# EAGLE design windmast2 (EAGLE 6.1)
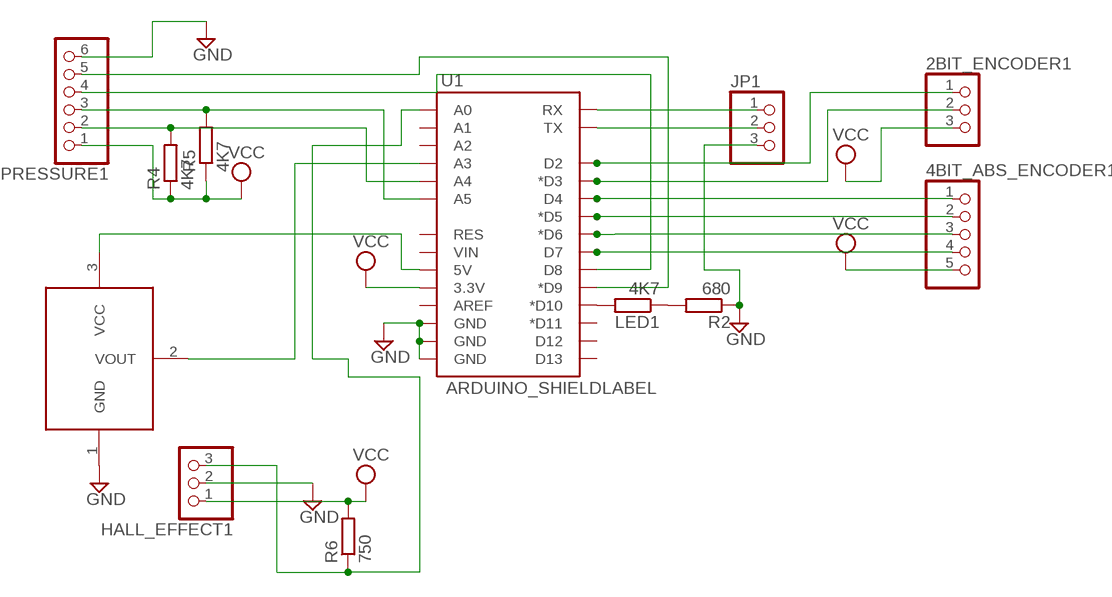
[diagram p0: schematic, sheet 1]

## Parts
2BIT_ENCODER1  PINHD-1X3  [1X03]
4BIT_ABS_ENCODER1  PINHD-1X5  [1X05]
HALL_EFFECT1  PINHD-1X3  [1X03]
IC1  LM35  [TO92]
JP1  PINHD-1X3  [1X03]
LED1  4K7  R-EU_R0805  [R0805]
PRESSURE1  PINHD-1X6  [1X06]
R2  680  R-EU_R0805  [R0805]
R4  4K7  R-EU_R0805  [R0805]
R5  4K7  R-EU_R0805  [R0805]
R6  750  R-EU_R0805  [R0805]
U1  ARDUINO_SHIELDLABEL  [DUEMILANOVE_SHIELD]

## Nets
GND: HALL_EFFECT1.2 IC1.1(GND) JP1.3 PRESSURE1.6 R2.1 U1.GND@0(GND) U1.GND@1(GND) U1.GND@2(GND)
N$1: IC1.2(VOUT) U1.A3
N$2: IC1.3(VCC) U1.5V
N$3: LED1.2 U1.D10(*D10)
N$4: LED1.1 R2.2
N$5: JP1.1 U1.RX
N$6: JP1.2 U1.TX
N$7: PRESSURE1.2 R4.2 U1.A4
N$13: PRESSURE1.3 R5.2 U1.A5
N$14: PRESSURE1.4 U1.D8
N$15: PRESSURE1.5 U1.D9(*D9)
N$16: 2BIT_ENCODER1.1 U1.D2
N$17: 2BIT_ENCODER1.2 U1.D3(*D3)
N$18: 4BIT_ABS_ENCODER1.1 U1.D4
N$19: 4BIT_ABS_ENCODER1.2 U1.D5(*D5)
N$20: 4BIT_ABS_ENCODER1.3 U1.D6(*D6)
N$21: 4BIT_ABS_ENCODER1.4 U1.D7
N$22: HALL_EFFECT1.3 R6.1 U1.A0
VCC: 2BIT_ENCODER1.3 4BIT_ABS_ENCODER1.5 HALL_EFFECT1.1 PRESSURE1.1 R4.1 R5.1 R6.2 U1.3.3V
Unconnected: U1.A1 U1.A2 U1.AREF U1.D11(*D11) U1.D12 U1.D13 U1.RES U1.VIN

## Library data of the parts
2BIT_ENCODER1 HALL_EFFECT1 JP1 = pinhead:PINHD-1X3: PIN HEADER
4BIT_ABS_ENCODER1 = pinhead:PINHD-1X5: PIN HEADER
IC1 = LM35:LM35
LED1 R2 R4-R6 = resistor:R-EU_: RESISTOR, European symbol
PRESSURE1 = pinhead:PINHD-1X6: PIN HEADER
U1 = SparkFun-Boards:ARDUINO_SHIELD: Arduino shield footprint

## Board
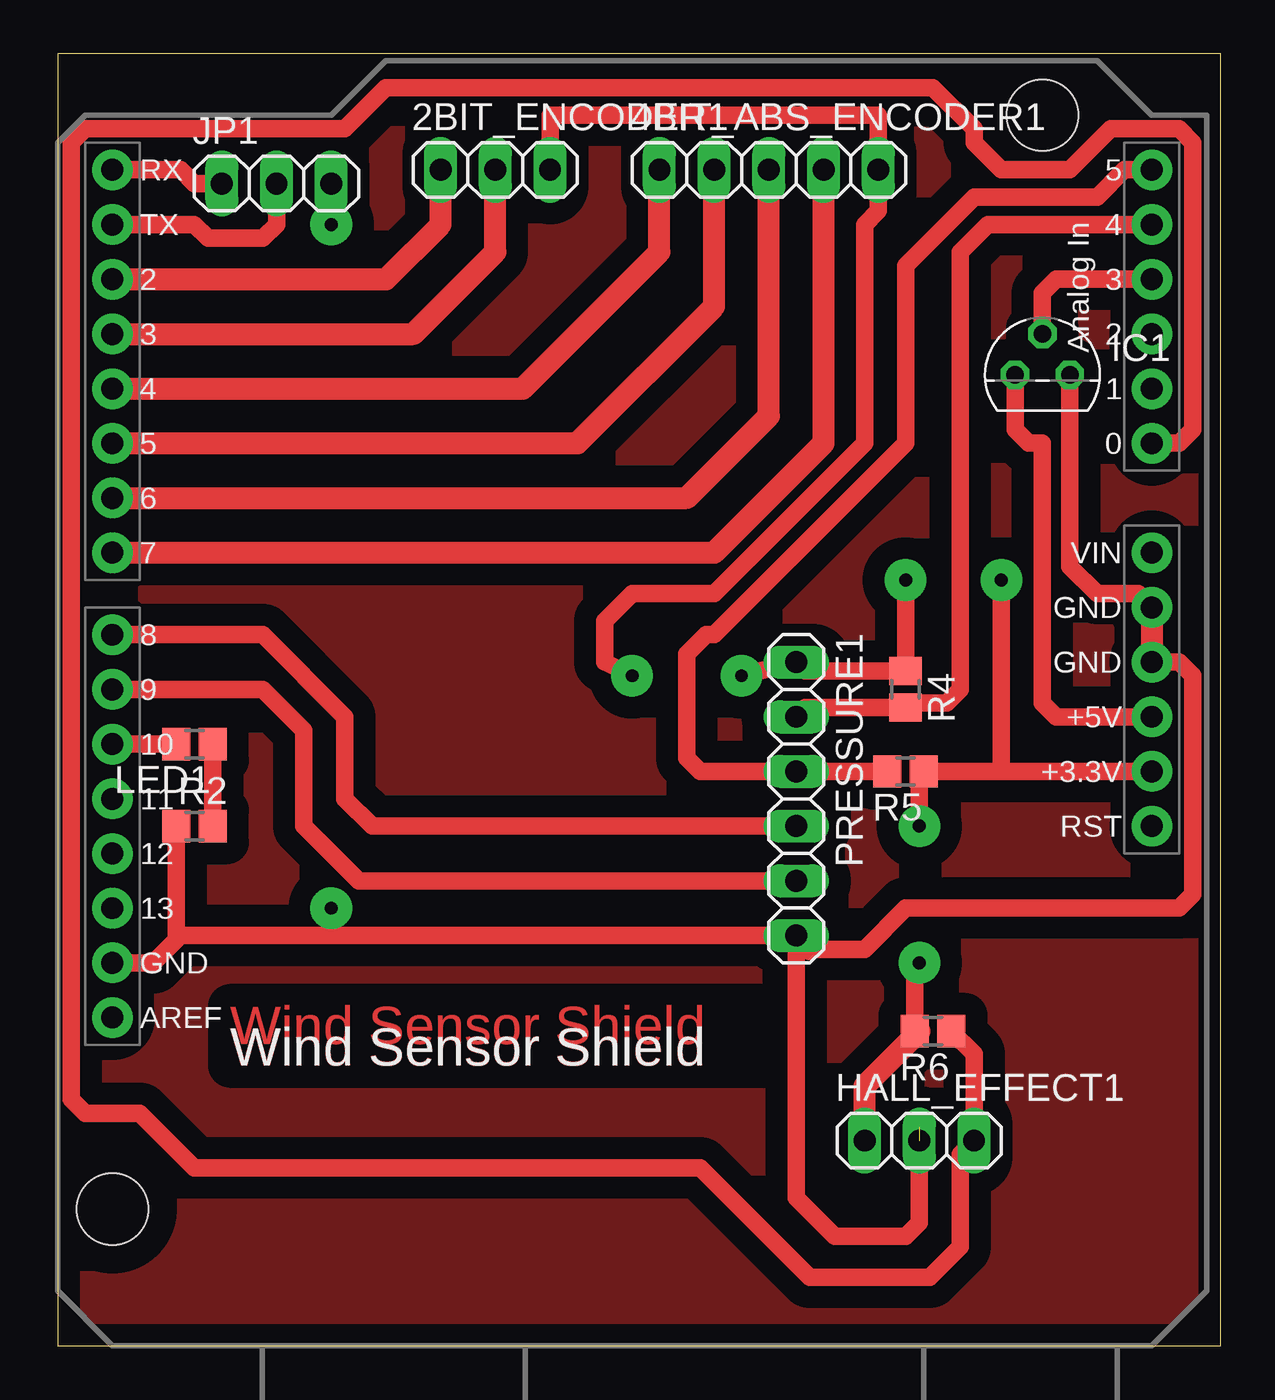
[diagram p1: board, top side]
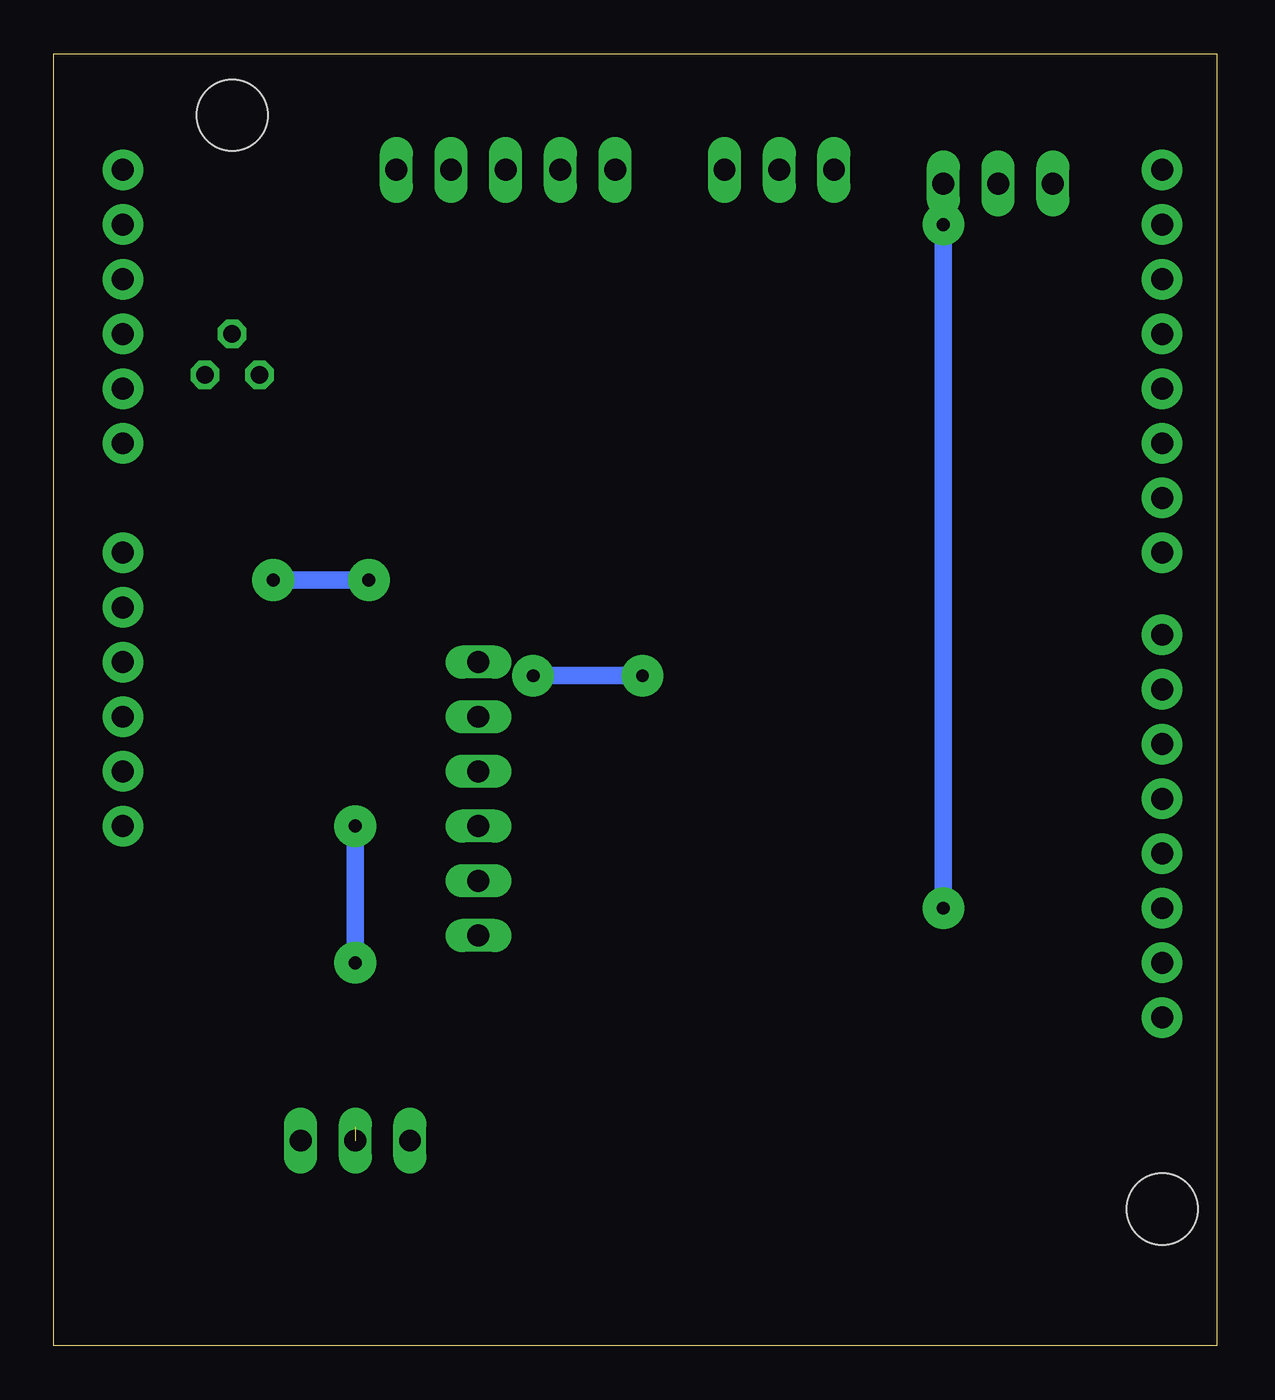
[diagram p2: board, bottom side, seen from below]

Size 54 x 60 mm. Coordinates in mm from the lower left corner, seen from the top.
Outline: 0,0 54,0 54,60 0,60 0,0
Copper layers (1*16): Top 0.035mm / dielectric 1.5mm / Bottom 0.035mm
Design rules: minimum track width 10mil, minimum drill 24mil, track to track 8mil, track to pad 8mil, pad to pad 8mil, via to via 8mil, smd to smd 8mil, copper to edge 40mil, drill to drill 8mil, minimum pad ring 10mil, minimum via ring 8mil, stop-mask expansion 4mil, vias tented up to drill 0mil, thermal gap 10mil

### Footprints (pad centres in the part's own frame; a part is rotated, then mirrored left to right if it is on the bottom)
1X03 = drill 1.016 long: 1 -2.54,0; 2 0,0; 3 2.54,0
1X05 = drill 1.016 long: 1 -5.08,0; 2 -2.54,0; 3 0,0; 4 2.54,0; 5 5.08,0
TO92 = drill 0.813 octagon: 1 1.27,0; 2 0,1.905; 3 -1.27,0
R0805 = smd 1.3 x 1.5: 1 -0.85,0; 2 0.85,0
1X06 = drill 1.016 long: 1 -6.35,0; 2 -3.81,0; 3 -1.27,0; 4 1.27,0; 5 3.81,0; 6 6.35,0
DUEMILANOVE_SHIELD = drill 1.016 pad 1.88: 3.3V 50.8,26.67; 5V 50.8,29.21; A0 50.8,41.91; A1 50.8,44.45; A2 50.8,46.99; A3 50.8,49.53; A4 50.8,52.07; A5 50.8,54.61; AREF 2.54,15.24; D2 2.54,49.53; D3 2.54,46.99; D4 2.54,44.45; D5 2.54,41.91; D6 2.54,39.37; D7 2.54,36.83; D8 2.54,33.02; D9 2.54,30.48; D10 2.54,27.94; D11 2.54,25.4; D12 2.54,22.86; D13 2.54,20.32; GND@0 50.8,31.75; GND@1 50.8,34.29; GND@2 2.54,17.78; RES 50.8,24.13; RX 2.54,54.61; TX 2.54,52.07; VIN 50.8,36.83 | hole 3.302: 45.72,57.15; 2.54,6.35

### Placement (x,y rotation side)
2BIT_ENCODER1  20.32,54.61 0 top
4BIT_ABS_ENCODER1  33.02,54.61 0 top
HALL_EFFECT1  40.01,9.53 0 top
IC1  45.72,45.09 0 top
JP1  10.16,53.98 0 top
LED1  6.35,27.94 180 top
PRESSURE1  34.29,25.4 270 top
R2  6.35,24.13 0 top
R4  39.37,30.48 270 top
R5  39.37,26.67 180 top
R6  40.64,14.61 180 top
U1  0,0 0 top

### Tracks (layer width: path | path; a pad name or v marks a point on that pad's centre or on a via)
GND  (via drill 0.6 pad 1.93)  (1 unrouted)
  Top 0.813: R2.1 5.5,19.05 | 5.5,19.05 5.5,18.84 4.45,17.78 U1.GND@2 | 12.7,19.05 PRESSURE1.6 34.29,6.88 36.09,5.08 39.37,5.08 40.01,5.71 40.01,10.16 | 12.7,19.05 5.5,19.05 | IC1.1 46.99,36.2 48.26,34.92 50.16,34.92 U1.GND@1 | U1.GND@0 52.07,31.75 52.7,31.11 52.7,20.95 52.07,20.32 39.37,20.32 37.47,18.41 34.92,18.41 | JP1.3 v12.7,52.07 | v12.7,20.32 12.7,19.05
  Top 1.016: U1.GND@1 U1.GND@0 | 34.92,18.41 PRESSURE1.6
  Bottom 0.813: v12.7,52.07 v12.7,20.32
N$1
  Top 0.813: IC1.2 45.72,48.9 46.35,49.53 U1.A3
N$2
  Top 0.813: IC1.3 44.45,42.55 45.09,41.91 45.72,41.91 45.72,29.84 46.35,29.21 U1.5V
N$3
  Top 0.813: U1.D10 LED1.2
N$4
  Top 0.813: LED1.1 R2.2
N$5
  Top 0.813: JP1.1 6.35,53.98 5.71,54.61 U1.RX
N$6
  Top 0.813: U1.TX 6.35,52.07 6.99,51.44 9.53,51.44 10.16,52.07 JP1.2
N$7
  Top 0.813: U1.A4 43.18,52.07 41.91,50.8 41.91,30.48 41.27,29.84 39.59,29.84 R4.2 34.71,29.63 PRESSURE1.2
N$8
  pour Top (isolate 1.016): 48.26,58.93 15.49,59.18 12.95,56.64 1.52,56.9 0.25,55.88 0.51,2.79 2.54,0.76 50.55,0.51 53.09,2.79 52.83,56.64 50.04,56.64
N$13
  Top 0.813: PRESSURE1.3 R5.2 29.84,26.67 29.21,27.3 29.21,32.12 30.11,33.02 30.48,33.02 39.37,41.91 39.37,50.16 42.55,53.34 48.26,53.34 49.53,54.61 U1.A5
N$14
  Top 0.813: U1.D8 9.53,33.02 13.34,29.21 13.34,25.4 14.61,24.13 PRESSURE1.4
N$15
  Top 0.813: U1.D9 9.53,30.48 11.43,28.57 11.43,24.13 13.97,21.59 PRESSURE1.5
N$16
  Top 1.016: U1.D2 15.24,49.53 17.78,52.07 2BIT_ENCODER1.1
N$17
  Top 1.016: U1.D3 16.51,46.99 20.32,50.8 2BIT_ENCODER1.2
N$18
  Top 1.016: U1.D4 21.59,44.45 27.94,50.8 4BIT_ABS_ENCODER1.1
N$19
  Top 1.016: U1.D5 24.13,41.91 30.48,48.26 4BIT_ABS_ENCODER1.2
N$20
  Top 1.016: U1.D6 29.21,39.37 33.02,43.18 4BIT_ABS_ENCODER1.3
N$21
  Top 1.016: U1.D7 30.48,36.83 35.56,41.91 4BIT_ABS_ENCODER1.4
N$22
  Top 0.813: U1.A0 52.07,41.91 52.7,42.55 52.7,55.88 52.07,56.52 48.9,56.52 46.99,54.61 43.81,54.61 42.55,55.88 42.55,56.52 40.64,58.42 15.24,58.42 13.34,56.52 1.27,56.52 0.64,55.88 0.64,11.43 1.27,10.79 3.81,10.79 6.35,8.26 29.84,8.26 34.92,3.17 40.49,3.17 41.91,4.59 41.91,8.89 HALL_EFFECT1.3 42.55,13.55 R6.1
VCC  (via drill 0.6 pad 1.93)
  Top 0.813: U1.3.3V 43.81,26.67 | 43.81,26.67 R5.1 40.01,26.45 v40.01,24.13 | 2BIT_ENCODER1.3 22.86,57.15 38.1,57.15 4BIT_ABS_ENCODER1.5 38.1,52.7 37.47,52.07 37.47,41.91 30.48,34.92 26.67,34.92 25.4,33.66 25.4,31.75 v26.67,31.11 | v31.75,31.11 PRESSURE1.1 34.71,31.33 R4.1 v39.37,35.56 | v43.81,35.56 43.81,26.67 | 40.01,14.61 R6.2 39.79,17.57 v40.01,17.78
  Top 1.016: HALL_EFFECT1.1 37.47,12.06 40.01,14.61
  Bottom 0.813: v31.75,31.11 v26.67,31.11 | v39.37,35.56 v43.81,35.56 | v40.01,17.78 v40.01,24.13

### Text on the board
Top: Wind Sensor Shield | Wind Sensor Shield | Wind Sensor Shield | Wind Sensor Shield | Wind Sensor Shield | Wind Sensor Shield
tNames: Wind Sensor Shield